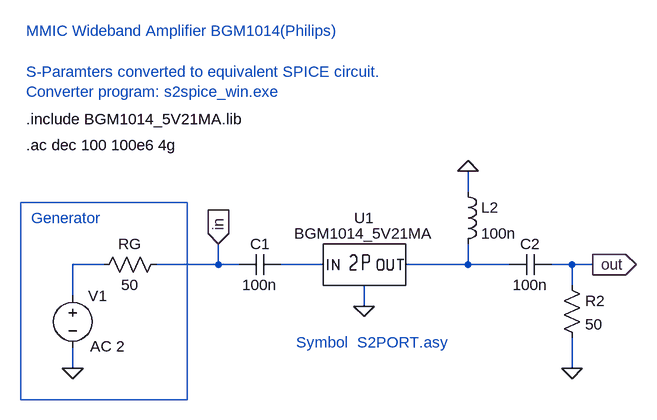
[diagram p0: schematic BGM1014_test1.asc]
BGM1014_test1.asc, the LTspice schematic file:
Version 4
SHEET 1 880 680
WIRE -112 176 -112 128
WIRE -112 288 -112 256
WIRE -64 128 -112 128
WIRE 112 128 16 128
WIRE 112 128 112 96
WIRE 144 128 112 128
WIRE 272 128 208 128
WIRE 336 192 336 160
WIRE 496 16 496 -16
WIRE 496 128 400 128
WIRE 496 128 496 96
WIRE 560 128 496 128
WIRE 656 128 624 128
WIRE 656 160 656 128
WIRE 656 288 656 240
WIRE 688 128 656 128
FLAG 656 288 0
FLAG -112 288 0
FLAG 496 -16 0
FLAG 336 192 0
FLAG 688 128 out
IOPIN 688 128 Out
FLAG 112 96 in
IOPIN 112 96 In
SYMBOL voltage -112 160 R0
WINDOW 123 27 94 Left 0
WINDOW 39 0 0 Left 0
SYMATTR InstName V1
SYMATTR Value ""
SYMATTR Value2 AC 2
SYMBOL res -80 144 R270
WINDOW 0 32 56 VTop 0
WINDOW 3 0 56 VBottom 0
SYMATTR InstName RG
SYMATTR Value 50
SYMBOL res 640 144 R0
SYMATTR InstName R2
SYMATTR Value 50
SYMBOL ind 480 0 R0
SYMATTR InstName L2
SYMATTR Value 100n
SYMBOL cap 560 144 R270
WINDOW 0 32 32 VTop 0
WINDOW 3 0 32 VBottom 0
SYMATTR InstName C2
SYMATTR Value 100n
SYMBOL cap 144 144 R270
WINDOW 0 32 32 VTop 0
WINDOW 3 0 32 VBottom 0
SYMATTR InstName C1
SYMATTR Value 100n
SYMBOL S2PORT 336 128 R0
SYMATTR Value BGM1014_5V21MA
SYMATTR InstName U1
TEXT -184 -96 Left 0 !.include BGM1014_5V21MA.lib
TEXT -184 -56 Left 0 !.ac dec 100 100e6 4g
TEXT -176 56 Left 0 ;Generator
TEXT -184 -232 Left 0 ;MMIC Wideband Amplifier BGM1014(Philips)\n \nS-Paramters converted to equivalent SPICE circuit.\nConverter program: s2spice_win.exe
TEXT 232 248 Left 0 ;Symbol  S2PORT.asy
RECTANGLE Normal 64 336 -192 32

The netlist it stands for:
* BGM1014_test1.asc
V1 N001 0 AC 2
RG N001 in 50
R2 out 0 50
L2 0 N003 100n
C2 N003 out 100n
C1 in N002 100n
XU1 N002 N003 0 BGM1014_5V21MA  ; pins 1 2 3
.include BGM1014_5V21MA.lib
.ac dec 100 100e6 4g
* Generator
* MMIC Wideband Amplifier BGM1014(Philips)
* S-Paramters converted to equivalent SPICE circuit.
* Converter program: s2spice_win.exe
* Symbol  S2PORT.asy
.backanno
.end